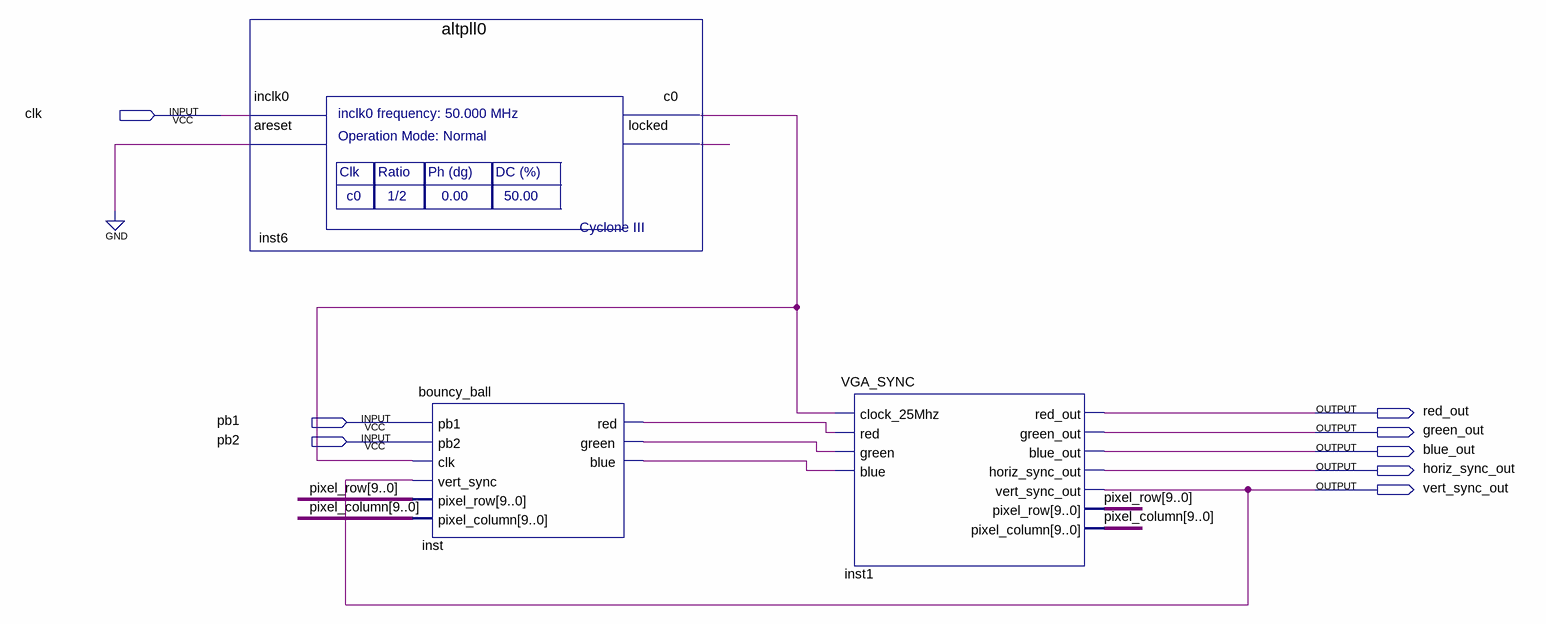
[diagram p0: schematic sheet]
// Quartus schematic test.bdf as structural Verilog: 3 symbols, 8 pins
module test (
  input  clk,
  input  pb1,
  input  pb2,
  output red_out,
  output green_out,
  output blue_out,
  output horiz_sync_out,
  output vert_sync_out
);

  wire inst6_c0, inst6_locked, inst_blue, inst_green, inst_red;
  wire [9:0] pixel_column, pixel_row;

  altpll0 inst6 (.inclk0(clk), .areset(1'b0), .c0(inst6_c0), .locked(inst6_locked));
  bouncy_ball inst (
    .pb1(pb1), .pb2(pb2), .clk(inst6_c0), .vert_sync(vert_sync_out), .pixel_row(pixel_row),
    .pixel_column(pixel_column), .red(inst_red), .green(inst_green), .blue(inst_blue));
  VGA_SYNC inst1 (
    .clock_25Mhz(inst6_c0), .red(inst_red), .green(inst_green), .blue(inst_blue), .red_out(red_out),
    .green_out(green_out), .blue_out(blue_out), .horiz_sync_out(horiz_sync_out),
    .vert_sync_out(vert_sync_out), .pixel_row(pixel_row), .pixel_column(pixel_column));
endmodule
